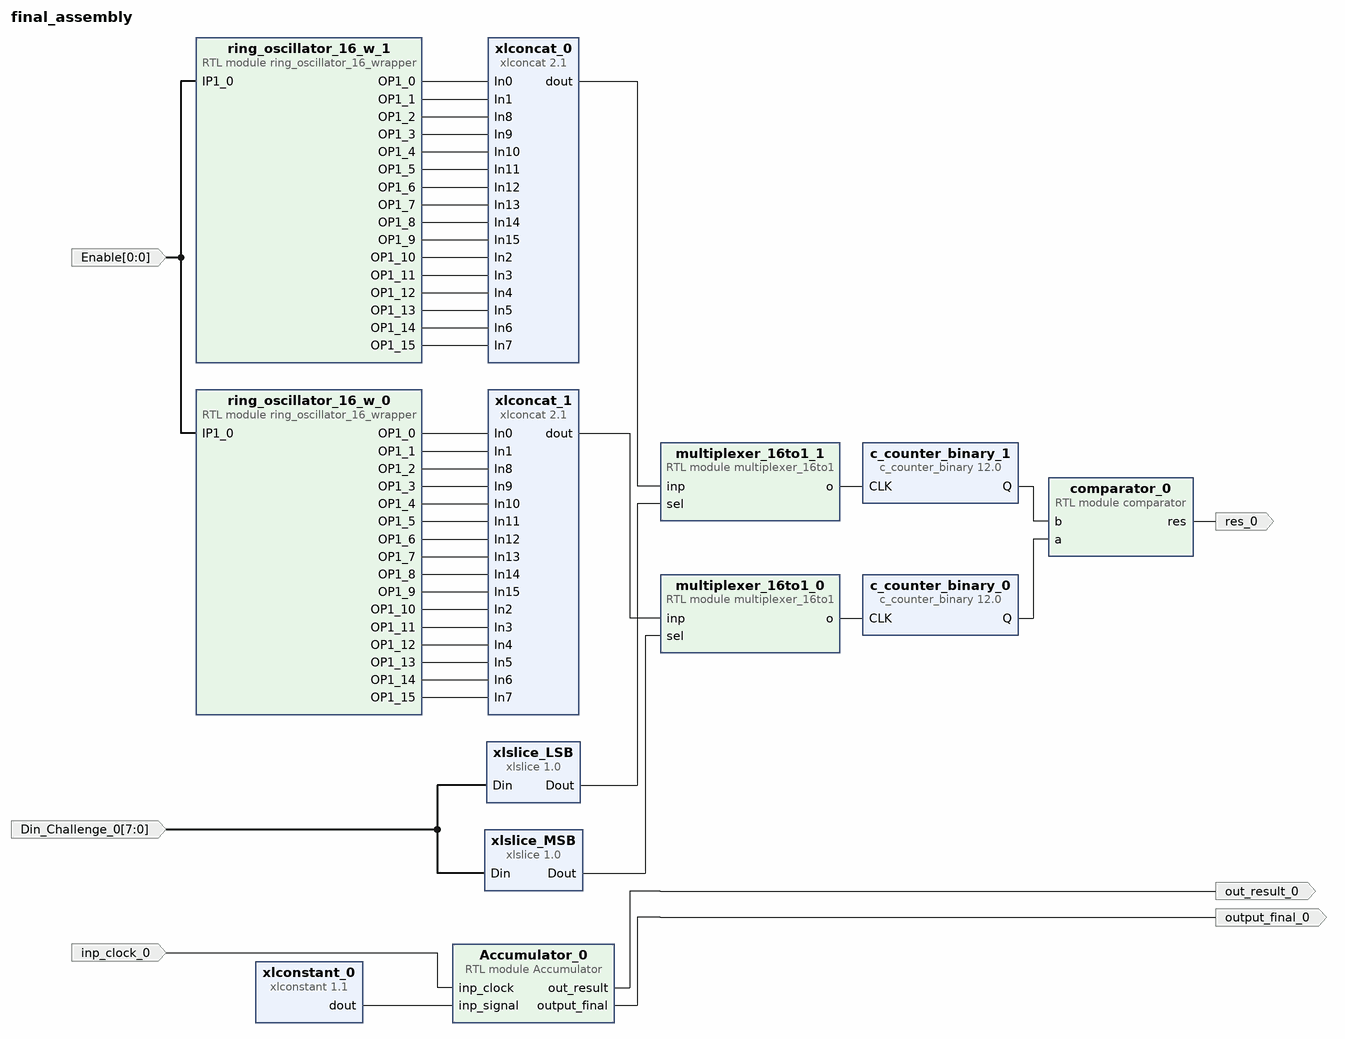
[diagram p0: block diagram of the top level]
# Vivado block design final_assembly, xc7z020clg400-1, Vivado 2021.1
create_bd_design final_assembly

create_bd_port -dir I -from 0 -to 0 Enable
create_bd_port -dir I -from 7 -to 0 Din_Challenge_0
create_bd_port -dir O out_result_0
create_bd_port -dir I -type clk inp_clock_0
create_bd_port -dir O output_final_0
create_bd_port -dir O res_0

create_bd_cell -type ip -vlnv xilinx.com:ip:xlconcat:2.1 xlconcat_0
set_property -dict {CONFIG.NUM_PORTS 16} [get_bd_cells xlconcat_0]
create_bd_cell -type ip -vlnv xilinx.com:ip:xlconcat:2.1 xlconcat_1
set_property -dict {CONFIG.NUM_PORTS 16} [get_bd_cells xlconcat_1]
create_bd_cell -type ip -vlnv xilinx.com:ip:c_counter_binary:12.0 c_counter_binary_0
set_property -dict {CONFIG.CE false CONFIG.Output_Width 12} [get_bd_cells c_counter_binary_0]
create_bd_cell -type ip -vlnv xilinx.com:ip:c_counter_binary:12.0 c_counter_binary_1
set_property -dict {CONFIG.Output_Width 12} [get_bd_cells c_counter_binary_1]
create_bd_cell -type ip -vlnv xilinx.com:ip:xlslice:1.0 xlslice_LSB
set_property -dict {CONFIG.DIN_FROM 3 CONFIG.DIN_TO 0 CONFIG.DIN_WIDTH 8 CONFIG.DOUT_WIDTH 4} [get_bd_cells xlslice_LSB]
create_bd_cell -type ip -vlnv xilinx.com:ip:xlslice:1.0 xlslice_MSB
set_property -dict {CONFIG.DIN_FROM 7 CONFIG.DIN_TO 4 CONFIG.DIN_WIDTH 8 CONFIG.DOUT_WIDTH 4} [get_bd_cells xlslice_MSB]
create_bd_cell -type module -reference multiplexer_16to1 multiplexer_16to1_0
create_bd_cell -type module -reference multiplexer_16to1 multiplexer_16to1_1
create_bd_cell -type module -reference comparator comparator_0
create_bd_cell -type module -reference Accumulator Accumulator_0
create_bd_cell -type ip -vlnv xilinx.com:ip:xlconstant:1.1 xlconstant_0
set_property -dict {CONFIG.CONST_VAL 0} [get_bd_cells xlconstant_0]
create_bd_cell -type module -reference ring_oscillator_16_wrapper ring_oscillator_16_w_0
create_bd_cell -type module -reference ring_oscillator_16_wrapper ring_oscillator_16_w_1

# ---- connections ----

connect_bd_net [get_bd_pins Accumulator_0/out_result] [get_bd_ports out_result_0]
connect_bd_net [get_bd_pins Accumulator_0/output_final] [get_bd_ports output_final_0]
connect_bd_net -net Din_0_1 [get_bd_ports Din_Challenge_0] [get_bd_pins xlslice_MSB/Din] [get_bd_pins xlslice_LSB/Din]
connect_bd_net -net IP1_0_0_1 [get_bd_ports Enable] [get_bd_pins ring_oscillator_16_w_0/IP1_0] [get_bd_pins ring_oscillator_16_w_1/IP1_0]
connect_bd_net [get_bd_pins c_counter_binary_0/Q] [get_bd_pins comparator_0/a]
connect_bd_net [get_bd_pins c_counter_binary_1/Q] [get_bd_pins comparator_0/b]
connect_bd_net [get_bd_pins comparator_0/res] [get_bd_ports res_0]
connect_bd_net -net inp_clock_0_1 [get_bd_ports inp_clock_0] [get_bd_pins Accumulator_0/inp_clock]
connect_bd_net [get_bd_pins multiplexer_16to1_0/o] [get_bd_pins c_counter_binary_0/CLK]
connect_bd_net [get_bd_pins multiplexer_16to1_1/o] [get_bd_pins c_counter_binary_1/CLK]
connect_bd_net [get_bd_pins ring_oscillator_16_w_0/OP1_0] [get_bd_pins xlconcat_1/In0]
connect_bd_net [get_bd_pins ring_oscillator_16_w_0/OP1_1] [get_bd_pins xlconcat_1/In1]
connect_bd_net [get_bd_pins ring_oscillator_16_w_0/OP1_2] [get_bd_pins xlconcat_1/In8]
connect_bd_net [get_bd_pins ring_oscillator_16_w_0/OP1_3] [get_bd_pins xlconcat_1/In9]
connect_bd_net [get_bd_pins ring_oscillator_16_w_0/OP1_4] [get_bd_pins xlconcat_1/In10]
connect_bd_net [get_bd_pins ring_oscillator_16_w_0/OP1_5] [get_bd_pins xlconcat_1/In11]
connect_bd_net [get_bd_pins ring_oscillator_16_w_0/OP1_6] [get_bd_pins xlconcat_1/In12]
connect_bd_net [get_bd_pins ring_oscillator_16_w_0/OP1_7] [get_bd_pins xlconcat_1/In13]
connect_bd_net [get_bd_pins ring_oscillator_16_w_0/OP1_8] [get_bd_pins xlconcat_1/In14]
connect_bd_net [get_bd_pins ring_oscillator_16_w_0/OP1_9] [get_bd_pins xlconcat_1/In15]
connect_bd_net [get_bd_pins ring_oscillator_16_w_0/OP1_10] [get_bd_pins xlconcat_1/In2]
connect_bd_net [get_bd_pins ring_oscillator_16_w_0/OP1_11] [get_bd_pins xlconcat_1/In3]
connect_bd_net [get_bd_pins ring_oscillator_16_w_0/OP1_12] [get_bd_pins xlconcat_1/In4]
connect_bd_net [get_bd_pins ring_oscillator_16_w_0/OP1_13] [get_bd_pins xlconcat_1/In5]
connect_bd_net [get_bd_pins ring_oscillator_16_w_0/OP1_14] [get_bd_pins xlconcat_1/In6]
connect_bd_net [get_bd_pins ring_oscillator_16_w_0/OP1_15] [get_bd_pins xlconcat_1/In7]
connect_bd_net [get_bd_pins ring_oscillator_16_w_1/OP1_0] [get_bd_pins xlconcat_0/In0]
connect_bd_net [get_bd_pins ring_oscillator_16_w_1/OP1_1] [get_bd_pins xlconcat_0/In1]
connect_bd_net [get_bd_pins ring_oscillator_16_w_1/OP1_2] [get_bd_pins xlconcat_0/In8]
connect_bd_net [get_bd_pins ring_oscillator_16_w_1/OP1_3] [get_bd_pins xlconcat_0/In9]
connect_bd_net [get_bd_pins ring_oscillator_16_w_1/OP1_4] [get_bd_pins xlconcat_0/In10]
connect_bd_net [get_bd_pins ring_oscillator_16_w_1/OP1_5] [get_bd_pins xlconcat_0/In11]
connect_bd_net [get_bd_pins ring_oscillator_16_w_1/OP1_6] [get_bd_pins xlconcat_0/In12]
connect_bd_net [get_bd_pins ring_oscillator_16_w_1/OP1_7] [get_bd_pins xlconcat_0/In13]
connect_bd_net [get_bd_pins ring_oscillator_16_w_1/OP1_8] [get_bd_pins xlconcat_0/In14]
connect_bd_net [get_bd_pins ring_oscillator_16_w_1/OP1_9] [get_bd_pins xlconcat_0/In15]
connect_bd_net [get_bd_pins ring_oscillator_16_w_1/OP1_10] [get_bd_pins xlconcat_0/In2]
connect_bd_net [get_bd_pins ring_oscillator_16_w_1/OP1_11] [get_bd_pins xlconcat_0/In3]
connect_bd_net [get_bd_pins ring_oscillator_16_w_1/OP1_12] [get_bd_pins xlconcat_0/In4]
connect_bd_net [get_bd_pins ring_oscillator_16_w_1/OP1_13] [get_bd_pins xlconcat_0/In5]
connect_bd_net [get_bd_pins ring_oscillator_16_w_1/OP1_14] [get_bd_pins xlconcat_0/In6]
connect_bd_net [get_bd_pins ring_oscillator_16_w_1/OP1_15] [get_bd_pins xlconcat_0/In7]
connect_bd_net [get_bd_pins xlconcat_0/dout] [get_bd_pins multiplexer_16to1_1/inp]
connect_bd_net [get_bd_pins xlconcat_1/dout] [get_bd_pins multiplexer_16to1_0/inp]
connect_bd_net [get_bd_pins xlconstant_0/dout] [get_bd_pins Accumulator_0/inp_signal]
connect_bd_net [get_bd_pins xlslice_LSB/Dout] [get_bd_pins multiplexer_16to1_1/sel]
connect_bd_net [get_bd_pins xlslice_MSB/Dout] [get_bd_pins multiplexer_16to1_0/sel]

validate_bd_design
save_bd_design
